# EAGLE design Balloon4 rev0 (EAGLE 7.3.0)
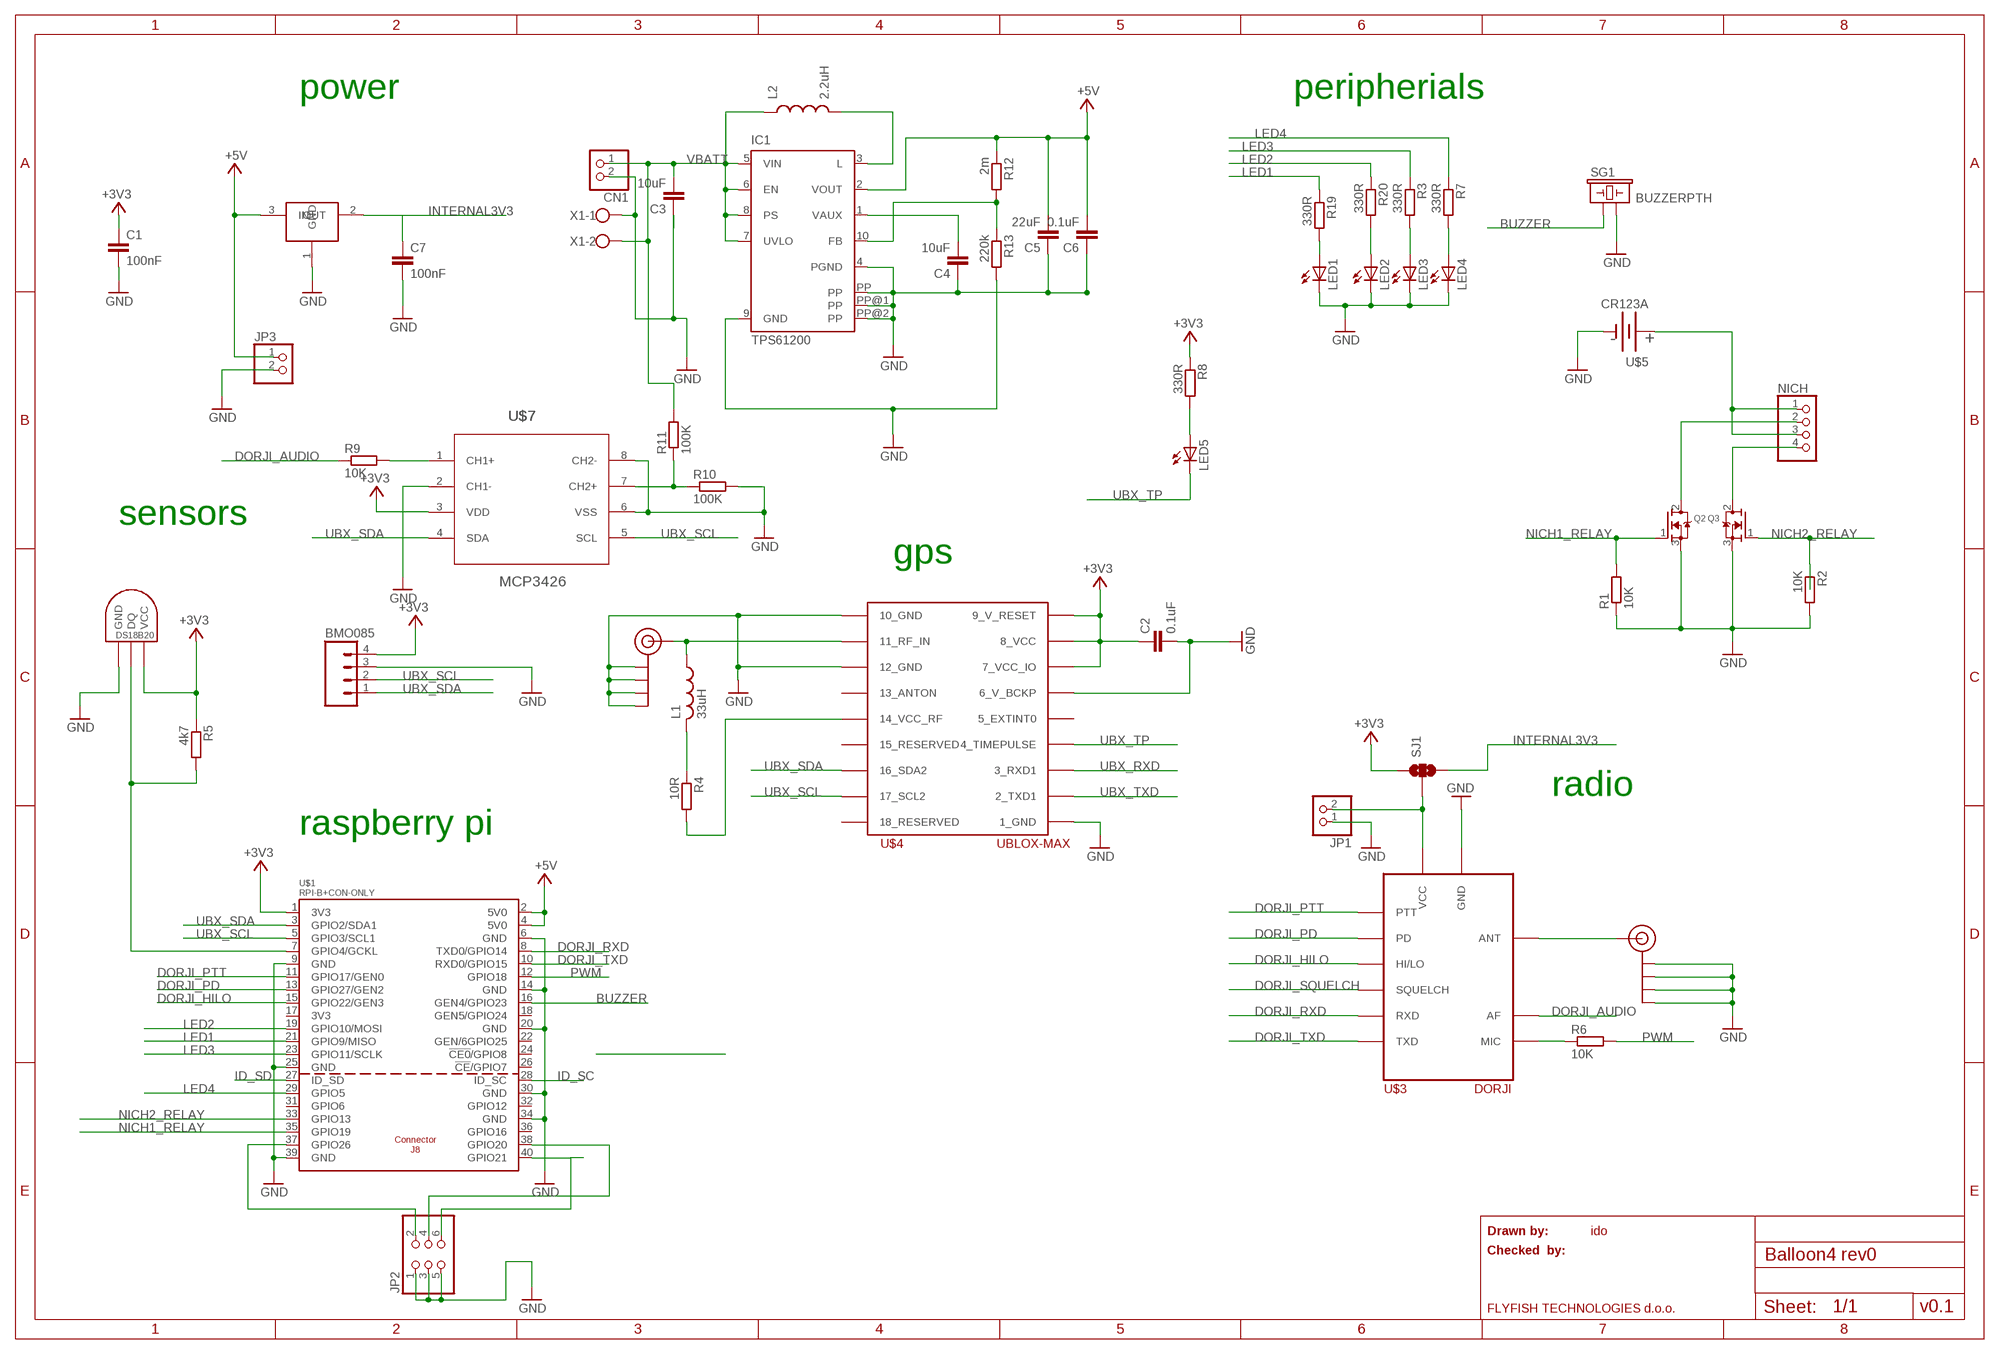
[diagram p0: schematic, sheet 1]

## Parts
BMO085  M04PTH  [1X04]
C1  100nF  C-EUC0805K  [C0805K]
C2  0.1uF  C-EUC0805K  [C0805K]
C3  10uF  C-EUC0805K  [C0805K]
C4  10uF  C-EUC0805K  [C0805K]
C5  22uF  C-EUC0805K  [C0805K]
C6  0.1uF  C-EUC0805K  [C0805K]
C7  100nF  C-EUC0805K  [C0805K]
CN1  JST_2PIN-SMT-RA  [JST-PH-2-SMT-RA]
IC1  TPS61200  [S-PDSO-N10]
J$1  SMA_EDGE  [SMA-EDGE]
J$2  SMA_EDGE  [SMA-EDGE]
JP1  PINHD-1X2  [1X02]
JP2  PINHD-2X3  [2X03]
JP3  PINHD-1X2  [1X02]
L1  33uH  INDUCTOR  [M0805]
L2  2.2uH  INDUCTOR  [INDUCTOR-SRP4020]
LED1  LEDCHIP-LED0805  [CHIP-LED0805]
LED2  LEDCHIP-LED0805  [CHIP-LED0805]
LED3  LEDCHIP-LED0805  [CHIP-LED0805]
LED4  LEDCHIP-LED0805  [CHIP-LED0805]
LED5  LEDCHIP-LED0805  [CHIP-LED0805]
NICH  PINHD-1X4  [1X04]
Q2  MOSFET-NGDS_TO220V  [TO220V]
Q3  MOSFET-NGDS_TO220V  [TO220V]
R1  10K  R-EU_M0805  [M0805]
R2  10K  R-EU_M0805  [M0805]
R3  330R  R-EU_M0805  [M0805]
R4  10R  R-EU_M0805  [M0805]
R5  4k7  R-EU_M0805  [M0805]
R6  10K  R-EU_M0805  [M0805]
R7  330R  R-EU_M0805  [M0805]
R8  330R  R-EU_M0805  [M0805]
R9  10K  R-EU_M0805  [M0805]
R10  100K  R-EU_M0805  [M0805]
R11  100K  R-EU_M0805  [M0805]
R12  2m  R-EU_M0805  [M0805]
R13  220k  R-EU_M0805  [M0805]
R19  330R  R-EU_M0805  [M0805]
R20  330R  R-EU_M0805  [M0805]
SG1  BUZZERPTH  [BUZZER-12MM]
SJ1  SOLDERJUMPER_2WAYPASTE1&2  [SJ_3_PASTE1&2]
U$1  RPI-B+CON-ONLY  [RPI-CON-B+]
U$2  NCP1117  [SOT223]
U$3  DORJI  [DORJI]
U$4  UBLOX-MAX  [UBLOX-MAX]
U$5  CR123A  [CR123A_HOLDER]
U$6  DS1820TO92  [DS1820]
U$7  MCP3426  [SOIC127P600X175-8N]
X1  W237-102  [W237-102]

## Nets
+3V3: BMO085.4 C1.1 C2.1 R5.1 R8.1 SJ1.1 U$1.1(3V3) U$4.7_VCC_IO U$4.8_VCC U$4.9_V_RESET U$6.VDD(VCC) U$7.3(VDD)
+5V: C5.2 C6.2 IC1.2(VOUT) JP3.1 R12.1 U$1.2(5V0) U$1.4(5V0) U$2.3(IN)
BUZZER: SG1.+ U$1.16(GEN4/GPIO23)
DORJI_AUDIO: R9.1 U$3.P$3(AF)
DORJI_HILO: U$1.15(GPIO22/GEN3) U$3.P$7(HI/LO)
DORJI_PD: U$1.13(GPIO27/GEN2) U$3.P$6(PD)
DORJI_PTT: U$1.11(GPIO17/GEN0) U$3.P$5(PTT)
DORJI_RXD: U$1.8(TXD0/GPIO14) U$3.P$16(RXD)
DORJI_SQUELCH: U$3.P$1(SQUELCH)
DORJI_TXD: U$1.10(RXD0/GPIO15) U$3.P$17(TXD)
GND: BMO085.3 C1.2 C2.2 C3.1 C4.1 C5.1 C6.1 C7.2 CN1.2 IC1.4(PGND) IC1.9(GND) IC1.PP IC1.PP@1(PP) IC1.PP@2(PP) J$1.GND@0(GND) J$1.GND@1(GND) J$1.GND@2(GND) J$1.GND@3(GND) J$2.GND@0(GND) J$2.GND@1(GND) J$2.GND@2(GND) J$2.GND@3(GND) JP1.1 JP2.1 JP2.3 JP2.5 JP3.2 LED1.C LED2.C LED3.C LED4.C Q2.3(S) Q3.3(S) R1.1 R2.2 R10.2 R13.2 SG1.- U$1.6(GND) U$1.9(GND) U$1.14(GND) U$1.20(GND) U$1.25(GND) U$1.30(GND) U$1.34(GND) U$1.39(GND) U$2.1(GND) U$3.P$9(GND) U$3.P$10(GND) U$4.1_GND U$4.6_V_BCKP U$4.10_GND U$4.12_GND U$5.- U$6.GND U$7.2(CH1-) U$7.6(VSS) U$7.8(CH2-) X1.1
ID_SC: U$1.28(ID_SC)
ID_SD: U$1.27(ID_SD)
INTERNAL3V3: C7.1 SJ1.3 U$2.2(OUT)
LED1: R19.1 U$1.21(GPIO9/MISO)
LED2: R20.1 U$1.19(GPIO10/MOSI)
LED3: R3.1 U$1.23(GPIO11/SCLK)
LED4: R7.1 U$1.29(GPIO5)
N$1: R6.1 U$3.P$18(MIC)
N$2: R5.2 U$1.7(GPIO4/GCKL) U$6.DQ
N$4: J$2.SIG(SIGNAL) U$3.P$12(ANT)
N$5: J$1.SIG(SIGNAL) L1.1 U$4.11_RF_IN
N$6: L1.2 R4.1
N$7: R4.2 U$4.14_VCC_RF
N$8: JP1.2 SJ1.2 U$3.P$8(VCC)
N$9: NICH.2 Q2.2(D)
N$11: IC1.3(L) L2.P$2
N$12: NICH.4 Q3.2(D)
N$13: JP2.2 U$1.37(GPIO26)
N$14: LED3.A R3.2
N$15: JP2.6 U$1.40(GPIO21)
N$16: JP2.4 U$1.38(GPIO20)
N$17: LED5.A R8.2
N$18: LED4.A R7.2
N$19: R10.1 R11.1 U$7.7(CH2+)
N$20: R9.2 U$7.1(CH1+)
N$21: IC1.10(FB)
N$22: R12.2 R13.1
N$23: C4.2 IC1.1(VAUX)
N$24: NICH.1 NICH.3 U$5.+
N$28: LED2.A R20.2
N$29: LED1.A R19.2
NICH1_RELAY: Q2.1(G) R1.2 U$1.35(GPIO19)
NICH2_RELAY: Q3.1(G) R2.1 U$1.33(GPIO13)
PWM: R6.2 U$1.12(GPIO18)
UBX_RXD: U$4.3_RXD1
UBX_SCL: BMO085.2 U$1.5(GPIO3/SCL1) U$4.17_SCL2 U$7.5(SCL)
UBX_SDA: BMO085.1 U$1.3(GPIO2/SDA1) U$4.16_SDA2 U$7.4(SDA)
UBX_TP: LED5.C U$4.4_TIMEPULSE
UBX_TXD: U$4.2_TXD1
VBATT: C3.2 CN1.1 IC1.5(VIN) IC1.6(EN) IC1.7(UVLO) IC1.8(PS) L2.P$1 R11.2 X1.2
Unconnected: U$1.17(3V3) U$1.18(GEN5/GPIO24) U$1.22(GEN/6GPIO25) U$1.24(!CE0!/GPIO8) U$1.26(!CE!/GPIO7) U$1.31(GPIO6) U$1.32(GPIO12) U$1.36(GPIO16) U$4.5_EXTINT0 U$4.13_ANTON U$4.15_RESERVED U$4.18_RESERVED

## Notes on the sheet
- power | peripherials
- sensors
- gps
- radio
- raspberry pi
- Drawn by: | ido
- Checked  by:
- FLYFISH TECHNOLOGIES d.o.o. | v0.1

## Library data of the parts
BMO085 = SparkFun-Connectors:M04: Header 4 Standard 4-pin 0.1" header. Use with straight break away headers (SKU : PRT-00116), right angle break away headers (PRT-00553), swiss pins (PRT-00743), machine pins (PRT-00117), and female headers (PRT-00115). Molex polarized connector foot print use with SKU : PRT-08231 with associated crimp pins and housings. 1MM SMD Version SKU: PRT-10208
C1 C7 = resistor:C-EU: CAPACITOR, European symbol; DIELECTRIC: X7R
C2-C6 = rcl:C-EU: CAPACITOR, European symbol
CN1 = adafruit:JST_2PIN: JST 2-Pin Connectors of various flavors SMT-RA (S2B-PH-SM4) 4UConnector #17311 SMT (B2B-PH-SM4) THM-RA (S2B-PH) THM (B2B-PH)
IC1 = texas:TPS6120*: LOW INPUT VOLTAGE SYNCHRONOUS BOOST CONVERTER WITH 1.3-A SWITCHES Source: http://focus.ti.com/lit/ds/symlink/tps61200.pdf; MPN: TPS61200DRCT; OC_FARNELL: 1471238; OC_NEWARK: 37M0066
J$1 J$2 = SparkFun-Connectors:SMA_EDGE: SMA Antenna Connector End launch SMA connector. The paste layer has been removed so that the connector can be hand soldered onto the board after reflow.
JP1 JP3 = pinhead:PINHD-1X2: PIN HEADER
JP2 = pinhead:PINHD-2X3: PIN HEADER
L1 = ido:INDUCTOR
L2 = SparkFun-Passives:INDUCTOR: Inductors Basic Inductor/Choke - 0603 and 1206. Footprints are not proven and vary greatly between part numbers. INDUCTOR POWER 3.3UH 4.0A SMD 0.197" L x 0.197" W x 0.177" H (5.00mm x 5.00mm x 4.50mm)
LED1-LED5 = led:LED: LED OSRAM: - CHIPLED LG R971, LG N971, LY N971, LG Q971, LY Q971, LO R971, LY R971 LH N974, LH R974 LS Q976, LO Q976, LY Q976 LO Q996 - Hyper CHIPLED LW Q18S LB Q993, LB Q99A, LB R99A - SideLED LS A670, LO A670, LY A670, LG A670, LP A670 LB A673, LV A673, LT A673, LW A673 LH A674 LY A675 LS A676, LA A676, LO A676, LY A676, LW A676 LS A679, LY A679, LG A679 - Hyper Micro SIDELED® LS Y876, LA Y876, LO Y876, LY Y876 LT Y87S - SmartLED LW L88C, LW L88S LB L89C, LB L89S, LG L890 LS L89K, LO L89K, LY L89K LS L896, LA L896, LO L896, LY L896 - TOPLED LS T670, LO T670, LY T670, LG T670, LP T670 LSG T670, LSP T670, LSY T670, LOP T670, LYG T670 LG T671, LOG T671, LSG T671 LB T673, LV T673, LT T673, LW T673 LH T674 LS T676, LA T676, LO T676, LY T676, LB T676, LH T676, LSB T676, LW T676 LB T67C, LV T67C, LT T67C, LS T67K, LO T67K, LY T67K, LW E67C LS E67B, LA E67B, LO E67B, LY E67B, LB E67C, LV E67C, LT E67C LW T67C LS T679, LY T679, LG T679 LS T770, LO T770, LY T770, LG T770, LP T770 LB T773, LV T773, LT T773, LW T773 LH T774 LS E675, LA E675, LY E675, LS T675 LS T776, LA T776, LO T776, LY T776, LB T776 LHGB T686 LT T68C, LB T68C - Hyper Mini TOPLED® LB M676 - Mini TOPLED Santana® LG M470 LS M47K, LO M47K, LY M47K Source: http://www.osram.convergy.de LUXEON: - LUMILED® LXK2-PW12-R00, LXK2-PW12-S00, LXK2-PW14-U00, LXK2-PW14-V00 LXK2-PM12-R00, LXK2-PM12-S00, LXK2-PM14-U00 LXK2-PE12-Q00, LXK2-PE12-R00, LXK2-PE12-S00, LXK2-PE14-T00, LXK2-PE14-U00 LXK2-PB12-K00, LXK2-PB12-L00, LXK2-PB12-M00, LXK2-PB14-N00, LXK2-PB14-P00, LXK2-PB14-Q00 LXK2-PR12-L00, LXK2-PR12-M00, LXK2-PR14-Q00, LXK2-PR14-R00 LXK2-PD12-Q00, LXK2-PD12-R00, LXK2-PD12-S00 LXK2-PH12-R00, LXK2-PH12-S00 LXK2-PL12-P00, LXK2-PL12-Q00, LXK2-PL12-R00 Source: www.luxeon.com KINGBRIGHT: KA-3528ASYC Source: www.kingbright.com
NICH = pinhead:PINHD-1X4: PIN HEADER
Q2 Q3 = adafruit:MOSFET-N: N-Channel Mosfet 2N7002E - 60V 260mA SOT23 [Digikey: 2N7002ET1GOSTR-ND] - REEL BSH103 - 30V 850mA SOT23 [Digikey: 568-5013-1-ND]
R1-R13 R19 R20 = rcl:R-EU_: RESISTOR, European symbol
SG1 = SparkFun-Electromechanical:BUZZER: Buzzer 12mm Spark Fun Electronics SKU : Comp-Buzzer
SJ1 = SparkFun-Retired:SOLDERJUMPER_2WAY: Solder Jumper 2 way solder jumper
U$1 = RaspberryPi:RPI-B+
U$2 = ido:NCP1117
U$3 = dorji:DORJI: DRA818V 2-Meter transceiver modul
U$4 = ido:UBLOX-MAX
U$5 = ido:CR123A
U$6 = Ava:DS1820: DS18B20 Programmable Resolution 1-Wire Digital Thermometer Description The DS18B20 digital thermometer provides 9-bit to 12-bit Celsius temperature measurements and has an alarm function with nonvolatile user-programmable upper and lower trigger points. The DS18B20 communicates over a 1-Wire® bus that by definition requires only one data line (and ground) for communication with a central microprocessor. It has an operating temperature range of -55°C to +125°C and is accurate to ±0.5°C over the range of -10°C to +85°C. In addition, the DS18B20 can derive power directly from the data line ("parasite power"), eliminating the need for an external power supply. Each DS18B20 has a unique 64-bit serial code, which allows multiple DS18B20s to function on the same 1-Wire bus. Thus, it is simple to use one microprocessor to control many DS18B20s distributed over a large area. Applications that can benefit from this feature include HVAC environmental controls, temperature monitoring systems inside buildings, equipment, or machinery, and process monitoring and control systems.
U$7 = Ava:MCP3426
X1 = con-wago-500:W237-102: WAGO SCREW CLAMP; MPN: 237-102; OC_FARNELL: unknown; OC_NEWARK: 70K9898

## Board
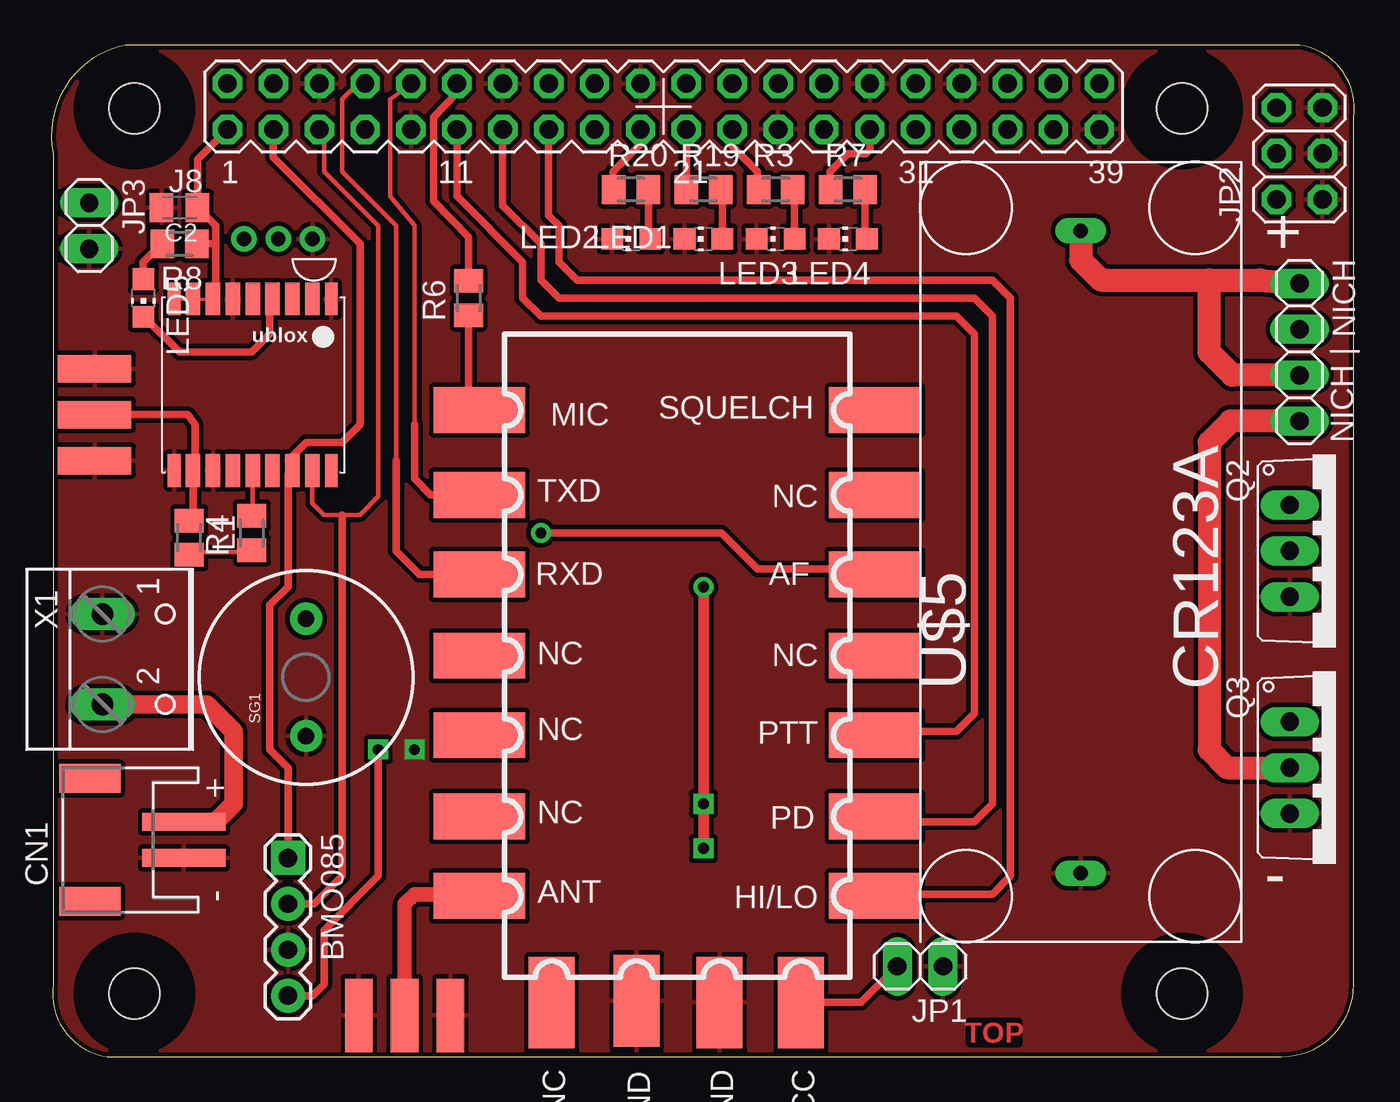
[diagram p1: board, top side]
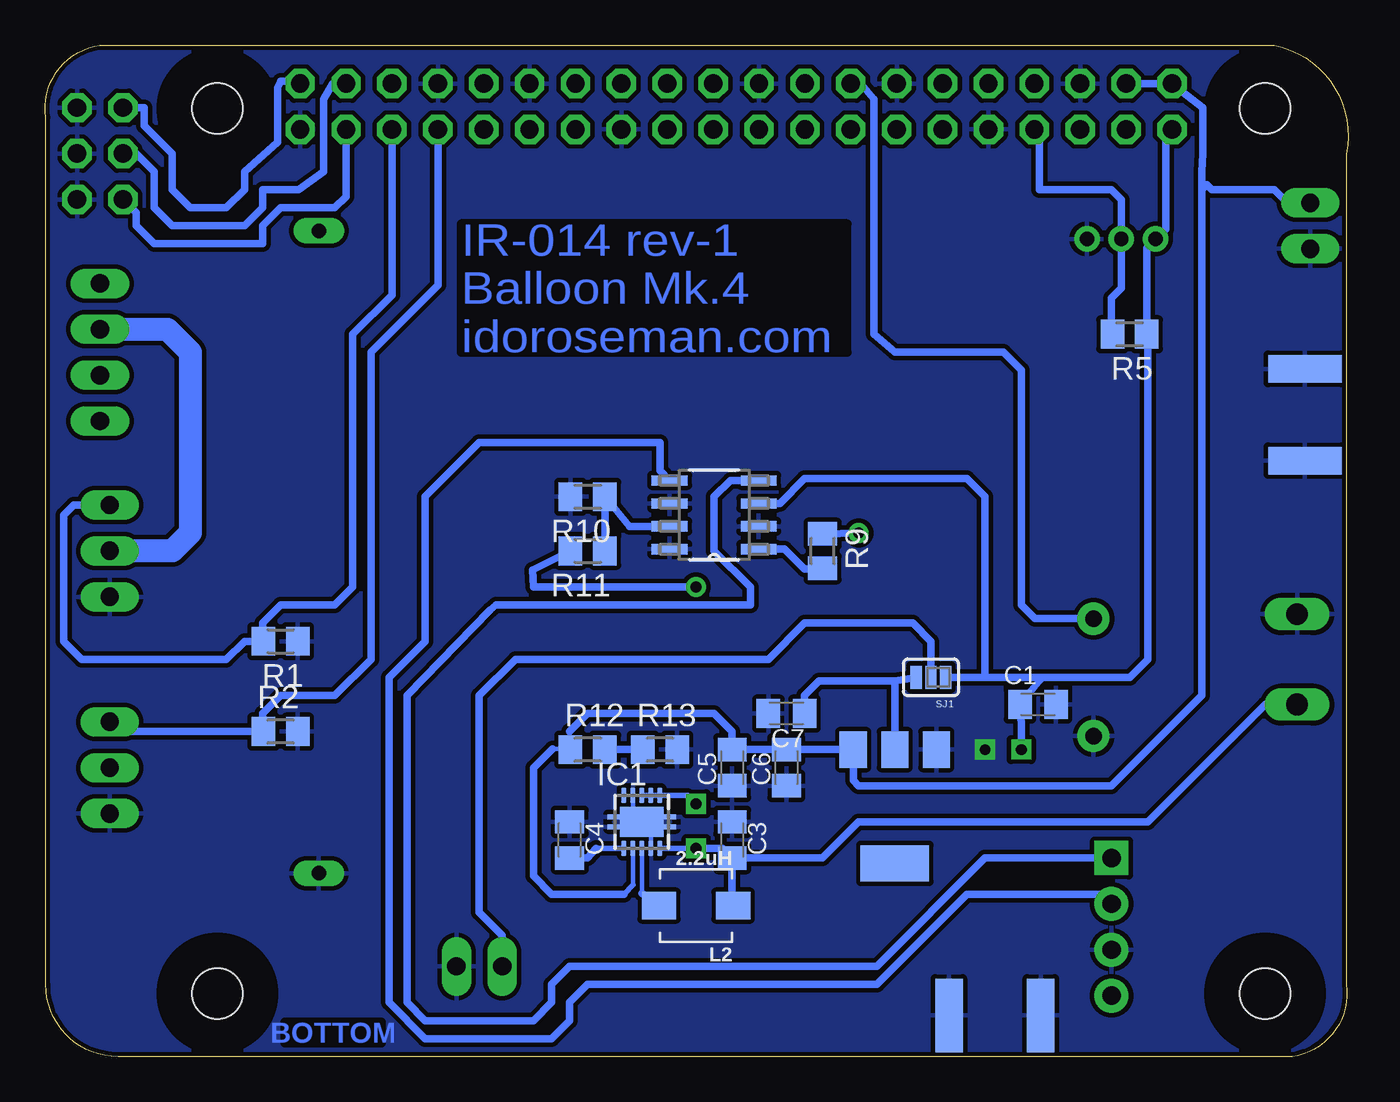
[diagram p2: board, bottom side, seen from below]

Size 72.13 x 56 mm. Coordinates in mm from the lower left corner, seen from the top.
Outline: 0.1,4 arc90 3.1,0 68.1,0 arc90 72.1,4 72.1,52 arc90 69.1,56 4.1,56 arc90 0.1,50 0.1,4
Copper layers (1*16): Top 0.035mm / dielectric 1.5mm / Bottom 0.035mm
Design rules "SparkFun": minimum track width 8mil, minimum drill 20mil, track to track 8mil, track to pad 8mil, pad to pad 8mil, via to via 8mil, smd to smd 8mil, copper to edge 10mil, drill to drill 8mil, minimum pad ring 12mil, minimum via ring 10mil, stop-mask expansion 4mil, vias tented up to drill 25mil, thermal gap 10mil
Holes 2.8 mm at 4.6,3.5 4.6,52.5 62.6,52.5 62.6,3.5
tRestrict: area 3,51 to 6.1,54; area 61,51 to 64.1,54; area 61,1.9 to 64.1,5; area 3,1.9 to 6.1,5
bRestrict: area 3,1.9 to 6.1,5; area 3,51 to 6.1,54; area 61,1.9 to 64.1,5; area 61,51 to 64.1,54

### Footprints (pad centres in the part's own frame; a part is rotated, then mirrored left to right if it is on the bottom)
1X04 = drill 1.016 pad 1.88 square: 1 0,0 | drill 1.016 pad 1.88: 2 2.54,0; 3 5.08,0; 4 7.62,0
C0805K = smd 1.3 x 1.6: 1 -1,0; 2 1,0
JST-PH-2-SMT-RA = smd 1 x 4.6: 1 1,-3.7; 2 -1,-3.7 | smd 1.6 x 3.4: NC1 -3.4,1.5; NC2 3.4,1.5
S-PDSO-N10 = smd 0.28 x 0.85: 1 -1,-1.475; 2 -0.5,-1.475; 3 0,-1.475; 4 0.5,-1.475; 5 1,-1.475; 6 1,1.475; 7 0.5,1.475; 8 0,1.475; 9 -0.5,1.475; 10 -1,1.475 | smd 2.4 x 1.65: PP 0,0 | smd 3.8 x 0.28: PP@1 0,0.275; PP@2 0,-0.275
SMA-EDGE = smd 1.524 x 4.064: GND@0 0,0; GND@1 5.08,0; SIG 2.54,0 | smd 1.524 x 4.064 bottom: GND@2 0,0; GND@3 5.08,0
1X02 = drill 1.016 long: 1 -1.27,0; 2 1.27,0
2X03 = drill 1.016 octagon: 1 -2.54,-1.27; 2 -2.54,1.27; 3 0,-1.27; 4 0,1.27; 5 2.54,-1.27; 6 2.54,1.27
M0805 = smd 1.3 x 1.6: 1 0.32,2.54; 2 2.22,2.54
INDUCTOR-SRP4020 = smd 1.9 x 1.5: P$1 -2.05,0; P$2 2.05,0
CHIP-LED0805 = smd 1.2 x 1.2: A 0,-1.05; C 0,1.05
1X04' = drill 1.016 long: 1 -3.81,0; 2 -1.27,0; 3 1.27,0; 4 3.81,0
TO220V = drill 1.016 long: 1 -2.54,-2.54; 2 0,-2.54; 3 2.54,-2.54
M0805' = smd 1.3 x 1.6: 1 -0.95,0; 2 0.95,0
BUZZER-12MM = drill 0.9 pad 1.778: + 3.25,0; - -3.25,0
SJ_3_PASTE1&2 = smd 0.635 x 1.27: 1 -0.813,0; 2 0,0; 3 0.813,0
RPI-CON-B+ = drill 1.016 octagon: 1 2.02,1.7; 2 2.02,4.24; 3 4.56,1.7; 4 4.56,4.24; 5 7.1,1.7; 6 7.1,4.24; 7 9.64,1.7; 8 9.64,4.24; 9 12.18,1.7; 10 12.18,4.24; 11 14.72,1.7; 12 14.72,4.24; 13 17.26,1.7; 14 17.26,4.24; 15 19.8,1.7; 16 19.8,4.24; 17 22.34,1.7; 18 22.34,4.24; 19 24.88,1.7; 20 24.88,4.24; 21 27.42,1.7; 22 27.42,4.24; 23 29.96,1.7; 24 29.96,4.24; 25 32.5,1.7; 26 32.5,4.24; 27 35.04,1.7; 28 35.04,4.24; 29 37.58,1.7; 30 37.58,4.24; 31 40.12,1.7; 32 40.12,4.24; 33 42.66,1.7; 34 42.66,4.24; 35 45.2,1.7; 36 45.2,4.24; 37 47.74,1.7; 38 47.74,4.24; 39 50.28,1.7; 40 50.28,4.24
SOT223 = smd 1.5 x 2: 1 -2.3,0; 2 0,0; 3 2.3,0 | smd 3.8 x 2: 4 0,6.3
DORJI = smd 2.54 x 5.08: P$1 4.2,20.5; P$2 8.9,20.5; P$3 13.3,20.5; P$4 17.8,20.5; P$5 22.2,20.5; P$6 26.7,20.5; P$7 31.1,20.5; P$12 31.1,-1.4; P$13 26.7,-1.4; P$14 22.2,-1.4; P$15 17.8,-1.4; P$16 13.3,-1.4; P$17 8.9,-1.4; P$18 4.2,-1.4 | smd 5.08 x 2.54: P$8 37,16.4; P$9 37,11.9; P$10 36.9,7.3; P$11 37,2.6
UBLOX-MAX = smd 1.8 x 0.7: 1_GND 4.95,-4.4; 9_V_RESET 4.95,4.3; 10_GND -4.55,4.3; 18_RESERVED -4.55,-4.4 | smd 1.8 x 0.8: 2_TXD1 4.95,-3.35; 3_RXD1 4.95,-2.25; 4_TIMEPULSE 4.95,-1.15; 5_EXTINT0 4.95,-0.05; 6_V_BCKP 4.95,1.05; 7_VCC_IO 4.95,2.15; 8_VCC 4.95,3.25; 11_RF_IN -4.55,3.25; 12_GND -4.55,2.15; 13_ANTON -4.55,1.05; 14_VCC_RF -4.55,-0.05; 15_RESERVED -4.55,-1.15; 16_SDA2 -4.55,-2.25; 17_SCL2 -4.55,-3.35
CR123A_HOLDER = drill 0.8 long: + 8.89,39.37; - 8.89,3.81
DS1820 = drill 0.8: DQ 2.54,-1.27; GND 0.635,-1.27; VDD 4.445,-1.27
SOIC127P600X175-8N = smd 1.981 x 0.559: 1 -2.464,1.905; 2 -2.464,0.635; 3 -2.464,-0.635; 4 -2.464,-1.905; 5 2.464,-1.905; 6 2.464,-0.635; 7 2.464,0.635; 8 2.464,1.905
W237-102 = drill 1.194 long: 1 -2.5,-1.27; 2 2.5,-1.27

### Placement (x,y rotation side)
BMO085  13.1,11 270 top
C1  17.17,19.5 0 bottom
C2  7.1,47 180 top
C3  34.1,12 270 bottom
C4  43.1,12 270 bottom
C5  34.1,16 90 bottom
C6  31.1,16 90 bottom
C7  31.1,19 180 bottom
CN1  3.64,12 90 top
IC1  39.1,13 0 bottom
J$1  2.39,33 90 top
J$2  22.1,2.29 180 top
JP1  48.1,5 180 top
JP2  69.1,50 90 top
JP3  2.1,46 270 top
L1  5.1,30 270 top
L2  36.1,8.37 180 bottom
LED1  36.1,45.27 90 top
LED2  32.1,45.27 90 top
LED3  40.1,45.27 90 top
LED4  44.1,45.27 90 top
LED5  5.1,42 180 top
NICH  [1X04']  69.1,39 270 top
Q2  71.1,28 270 top
Q3  71.1,16 270 top
R1  10K  [M0805']  59.1,23 180 bottom
R2  10K  [M0805']  59.1,18 0 bottom
R3  330R  [M0805']  40.1,48 0 top
R4  10R  [M0805']  11.1,29 90 top
R5  4k7  [M0805']  12.1,40 180 bottom
R6  10K  [M0805']  23.1,42 90 top
R7  330R  [M0805']  44.1,48 0 top
R8  330R  [M0805']  7.1,45 180 top
R9  10K  [M0805']  29.1,28 270 bottom
R10  100K  [M0805']  42.1,31 180 bottom
R11  100K  [M0805']  42.1,28 180 bottom
R12  2m  [M0805']  42.1,17 0 bottom
R13  220k  [M0805']  38.1,17 0 bottom
R19  330R  [M0805']  36.1,48 0 top
R20  330R  [M0805']  32.1,48 0 top
SG1  14.1,21 90 top
SJ1  23.1,21 180 bottom
U$1  7.73,49.63 0 top
U$2  25.1,17 180 bottom
U$3  25.1,40 270 top
U$4  11.1,37 90 top
U$5  48.1,6.35 0 top
U$6  15.1,44 180 top
U$7  35.1,30 180 bottom
X1  4.1,22 270 top

### Tracks (layer width: path | path; a pad name or v marks a point on that pad's centre or on a via)
+3V3  (via drill 0.6)
  Top 0.152: U$4.9_V_RESET 6.81,41.91 7.77,41.91 U$4.8_VCC 8.08,41.91 8.72,41.91 U$4.7_VCC_IO
  Top 0.254: 9.1,42.1 U$4.7_VCC_IO
  Top 0.406: 9.1,42.1 9.1,45 | 9.1,45 9.1,46 C2.1 8.1,49.68 U$1.1 | BMO085.4 14.48,3.38 15.1,4 15.1,7 18.1,10 v18.1,17 | R8.1 9.1,45
  Bottom 0.406: SJ1.1 20.1,21 | 20.1,21 17.1,21 17.02,20.93 | 17.02,20.93 C1.1 18.1,18.43 v18.1,17 | U$1.1 10.1,50.99 10.1,45.83 U$6.VDD 11.15,44.77 R5.1 11.1,39.95 11.1,22 12.1,21 16.95,21 17.02,20.93 | U$7.3 31.46,30.64 30.1,32 21.1,32 20.1,31 20.1,21
+5V
  Bottom 0.254: IC1.2 39.6,9.5 | 43.1,18 43.1,17.05 | 44.05,17.05 43.1,17.05 | 43.1,17.05 R12.1
  Bottom 0.305: 39.6,9.5 40.1,9
  Bottom 0.406: 40.1,9 44.1,9 45.1,10 45.1,16 44.05,17.05 | 8.1,48 8.1,20 13.1,15 27.1,15 27.4,15.3 U$2.3 C6.2 C5.2 34.1,18 35.1,19 42.1,19 43.1,18 | 8.1,48 8.1,49 8.06,50 8.06,52.53 U$1.2 U$1.4 | 8.1,48 7.83,48.27 7.56,48 4.1,48 3.37,47.27 JP3.1
BUZZER
  Bottom 0.406: U$1.16 26.97,53.88 26.24,53 26.24,40 25.1,39 19.1,39 18.1,38 18.1,25 17.35,24.25 SG1.+
DORJI_AUDIO  (via drill 0.6)
  Top 0.406: v27.1,29 37.1,29 39.1,27 45.3,27 U$3.P$3
  Bottom 0.406: R9.1 v27.1,29
DORJI_HILO
  Top 0.406: U$1.15 27.53,46.56 28.1,46 28.1,44 29.1,43 52.1,43 53.1,42 53.1,10 52.1,9 45.7,9 U$3.P$7
DORJI_PD
  Top 0.406: U$3.P$6 45.9,13 51.1,13 52.1,14 52.1,41 51.1,42 28.1,42 27.1,43 27.1,45 24.99,47.1 U$1.13
DORJI_PTT
  Top 0.406: U$1.11 22.45,47.65 26.1,44 26.1,42 27.1,41 50.1,41 51.1,40 51.1,19 50.1,18 45.8,18 U$3.P$5
DORJI_RXD
  Top 0.254: U$1.8 16.97,53.88 16.1,53 16.1,49 19.1,46 19.1,33
  Top 0.406: U$3.P$16 20.4,26.7 19.1,28 19.1,33
DORJI_TXD
  Top 0.254: U$1.10 19.91,53.81 18.75,53 18.75,47.63 20.1,46 20.1,35
  Top 0.406: U$3.P$17 21,31.1 20.1,32 20.1,35
GND  (via drill 0.6)
  Bottom 0.254: IC1.4 38.6,12.5 | IC1.9 39.6,13.5
  Bottom 0.406: 38.6,12.5 IC1.PP 39.6,13.5
  other vias: 20.1,17
  pour Bottom (isolate 0.254): 0.1,5 arc90 4.1,0 67.1,0 arc90 72.1,3 72.1,53 arc90 69.1,56 4.1,56 arc90 0.1,51
  pour Top (isolate 0.254): 0.1,3 arc90 4.1,0 68.1,0 arc90 72.1,3 72.1,53 arc90 68.1,56 4.1,56 arc90 0.1,51
INTERNAL3V3
  Bottom 0.406: U$2.2 25.1,20.81 | 25.1,20.81 SJ1.3 | 25.1,20.81 29.29,20.81 30.1,20 C7.1
LED1
  Top 0.406: U$1.21 R19.1
LED2
  Top 0.406: U$1.19 32.61,50.52 31.1,49 31.1,48.05 R20.1
LED3
  Top 0.406: U$1.23 37.69,50.41 39.1,49 39.1,48.05 R3.1
LED4
  Top 0.406: U$1.29 45.31,50.22 45.1,50 44.1,50 43.1,49 43.1,48.05 R7.1
N$1
  Top 0.406: R6.1 23.1,36.4 U$3.P$18
N$2
  Bottom 0.406: U$1.7 17.1,51.06 17.1,48 13.1,48 12.56,47.46 U$6.DQ 12.56,42.54 13.1,42 13.1,40.05 R5.2
N$4
  Top 0.813: J$2.SIG 19.56,8.46 20.1,9 23.6,9 U$3.P$12
N$5
  Top 0.254: 7.85,29.68 L1.1 7.5,29.54
  Top 0.406: 7.85,29.68 U$4.11_RF_IN 7.96,32.7 7.96,35 7.56,35.54 J$1.SIG
N$6
  Top 0.254: L1.2 7.77,27.94 10.94,27.94 R4.1
N$7
  Top 0.254: R4.2 11.15,29.95 U$4.14_VCC_RF
N$8
  Top 0.406: U$3.P$8 44.83,3 JP1.2
  Bottom 0.406: SJ1.2 23.1,23 24.1,24 30.1,24 32.1,22 46.1,22 48.1,20 48.1,8 46.83,6.73 JP1.2
N$9
  Bottom 1.27: NICH.2 65.37,40.27 64.1,39 64.1,29 65.1,28 Q2.2
N$11
  Bottom 0.254: IC1.3 39.1,9.05
  Bottom 0.406: 39.1,9.05 L2.P$2
N$12
  Top 1.27: NICH.4 65.29,35.19 64.1,34 64.1,17 65.1,16 Q3.2
N$13
  Bottom 0.406: U$1.37 55.47,47.62 56.1,47 59.1,47 60.1,46 60.1,45 66.1,45 67.1,46 67.1,46.73 JP2.2
N$14
  Top 0.406: LED3.A 41.15,47.9 R3.2
N$15
  Bottom 0.406: JP2.6 66.64,52.54 66.64,51.54 65.1,50 65.1,48 64.1,47 62.1,47 61.1,48 61.1,49 59.26,50.63 59.26,53.63 59.1,54 58.14,54 U$1.40
N$16
  Bottom 0.406: U$1.38 56.22,53.88 56.72,53 56.72,49 58.1,48 60.1,48 60.1,47 61.1,46 65.1,46 66.1,47 66.1,49 67.1,50 JP2.4
N$17
  Top 0.406: R8.2 6.1,45 5.1,44 LED5.A
N$18
  Top 0.406: R7.2 45.05,45.37 LED4.A
N$19
  Bottom 0.406: R11.1 R10.1 39.78,29.36 U$7.7
N$20
  Bottom 0.406: U$7.1 31.19,28.09 30.1,27 29.15,27 R9.2
N$22
  Bottom 0.406: R12.2 R13.1
N$23
  Bottom 0.305: IC1.1 41.62,11.53
  Bottom 0.406: 41.62,11.53 42.1,11 C4.2
N$24
  Top 1.27: U$5.+ 56.99,44.11 58.1,43 64.1,43 | 64.1,43 66.91,43 NICH.1 | NICH.3 65.37,37.73 64.1,39 64.1,43
N$28
  Top 0.406: R20.2 33.05,45.37 LED2.A
N$29
  Top 0.406: LED1.A 37.15,47.9 R19.2
NICH1_RELAY
  Bottom 0.406: Q2.1 70.56,30.54 71.1,30 71.1,23 70.1,22 62.1,22 61.1,23 R1.2 60.1,23.05 60.1,24 59.1,25 56.1,25 55.1,26 55.1,40 52.93,42.16 U$1.35
NICH2_RELAY
  Bottom 0.406: 60.1,18 68.02,18 Q3.1 | 60.1,18 60.1,19 59.1,20 56.1,20 54.1,22 54.1,39 50.39,42.7 U$1.33 | 60.1,18 R2.1
PWM
  Top 0.406: U$1.12 22.45,53.35 21.16,52 21.16,47.37 23.1,45.37 R6.2
UBX_SCL
  Top 0.254: U$1.5 15.1,51.07 15.1,49 18.1,46 18.1,31 17.1,30 16.1,30 15.1,30 14.45,30.65 U$4.17_SCL2
  Top 0.406: BMO085.2 14.56,8.46 16.1,10 16.1,30
  Bottom 0.406: BMO085.2 13.64,9 21.1,9 26.1,4 42.1,4 43.1,3 43.1,2 44.1,1 51.1,1 53.1,3 53.1,21 51.1,23 51.1,31 48.1,34 38.1,34 38.1,32.44 U$7.5
UBX_SDA
  Top 0.254: 13.1,33 13.1,32.7 U$4.16_SDA2
  Top 0.406: U$1.3 12.29,49.8 17.1,45 17.1,35 16.1,34 14.1,34 13.1,33 | BMO085.1 13.1,16 12.1,17 12.1,25 13.1,26 13.1,32.2 U$4.16_SDA2
  Bottom 0.406: BMO085.1 20.1,11 26.1,5 43.1,5 44.1,4 44.1,3 45.1,2 51.1,2 52.1,3 52.1,20 47.51,24.72 47.16,25 33.1,25 33.1,26 35.1,28 35.1,31 34.19,31.91 U$7.4
UBX_TP
  Top 0.406: LED5.C 5.15,40.95 7.1,39 11.1,39 12.1,40 12.1,41.8 U$4.4_TIMEPULSE
VBATT  (via drill 0.6)
  Top 0.61: v36.1,26 v36.1,14 v36.1,11.53
  Top 1.016: X1.2 8.6,19.5 10.1,18 10.1,14 9.1,13 CN1.1
  Bottom 0.305: v36.1,14 36.57,14.47 IC1.6 IC1.7 IC1.8 | v36.1,11.53 IC1.5
  Bottom 0.406: C3.2 29.1,11 27.1,13 11.1,13 4.6,19.5 X1.2 | R11.2 45.15,26.95 45.1,26 v36.1,26 | v36.1,11.53 34.62,11.53 C3.2 | C3.2 34.1,8.41 L2.P$1

### Text on the board
Top: TOP
Bottom: IR-014 rev-1 / Balloon Mk.4 / idoroseman.com | BOTTOM
tPlace: NICH |